# Altium schematic sheet serpentine2.SchDoc
size A4
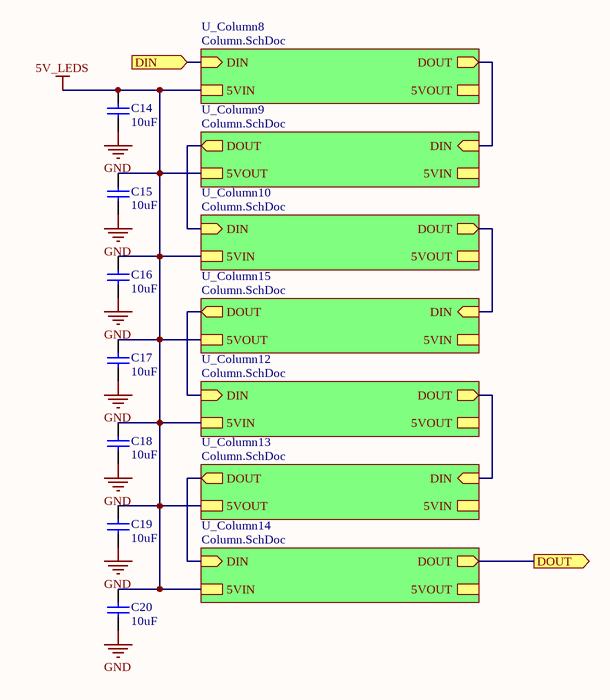
[diagram p0: serpentine2.SchDoc]

## Parts
C14  10uF  [CAP0603]
C15  10uF  [CAP1206]
C16  10uF  [CAP1206]
C17  10uF  [CAP1206]
C18  10uF  [CAP1206]
C19  10uF  [CAP1206]
C20  10uF  [CAP1206]

## Sub-sheets
U_Column8 = Column.SchDoc: DIN (in), DOUT (out), 5VIN, 5VOUT
U_Column9 = Column.SchDoc: DIN (in), DOUT (out), 5VIN, 5VOUT
U_Column10 = Column.SchDoc: DIN (in), DOUT (out), 5VIN, 5VOUT
U_Column12 = Column.SchDoc: DIN (in), DOUT (out), 5VIN, 5VOUT
U_Column13 = Column.SchDoc: DIN (in), DOUT (out), 5VIN, 5VOUT
U_Column14 = Column.SchDoc: DIN (in), DOUT (out), 5VIN, 5VOUT
U_Column15 = Column.SchDoc: DIN (in), DOUT (out), 5VIN, 5VOUT

## Ports
DIN (in), DOUT (out)

## Nets
5V_LEDS: C14.2 C15.2 C16.2 C17.2 C18.2 C19.2 C20.2 ; sheet U_Column8/5VIN, sheet U_Column9/5VOUT, sheet U_Column10/5VIN, sheet U_Column12/5VIN, sheet U_Column13/5VOUT, sheet U_Column14/5VIN, sheet U_Column15/5VOUT
GND: C14.1 C15.1 C16.1 C17.1 C18.1 C19.1 C20.1
DIN: port DIN, sheet U_Column8/DIN
DOUT: port DOUT, sheet U_Column14/DOUT
(unnamed): sheet U_Column8/DOUT, sheet U_Column9/DIN
(unnamed): sheet U_Column9/DOUT, sheet U_Column10/DIN
(unnamed): sheet U_Column10/DOUT, sheet U_Column15/DIN
(unnamed): sheet U_Column12/DIN, sheet U_Column15/DOUT
(unnamed): sheet U_Column12/DOUT, sheet U_Column13/DIN
(unnamed): sheet U_Column13/DOUT, sheet U_Column14/DIN

## Library data of the parts
C14-C20 = CAP: C342827; Value: 1µF; Rated voltage: 25V; Tolerance: 10%; Manufacturer: *; Manufacturer P/N: *; Order code Farnell: 1288202RL; Power: *; Technology: X5R; Temperature  Factor: *; Temperature Max: +125°C; Temperature Min: -55°C; STS Code: *